# EAGLE design OSO-MISC-20-004 Pulse Oximetry (EAGLE 9.4.2)
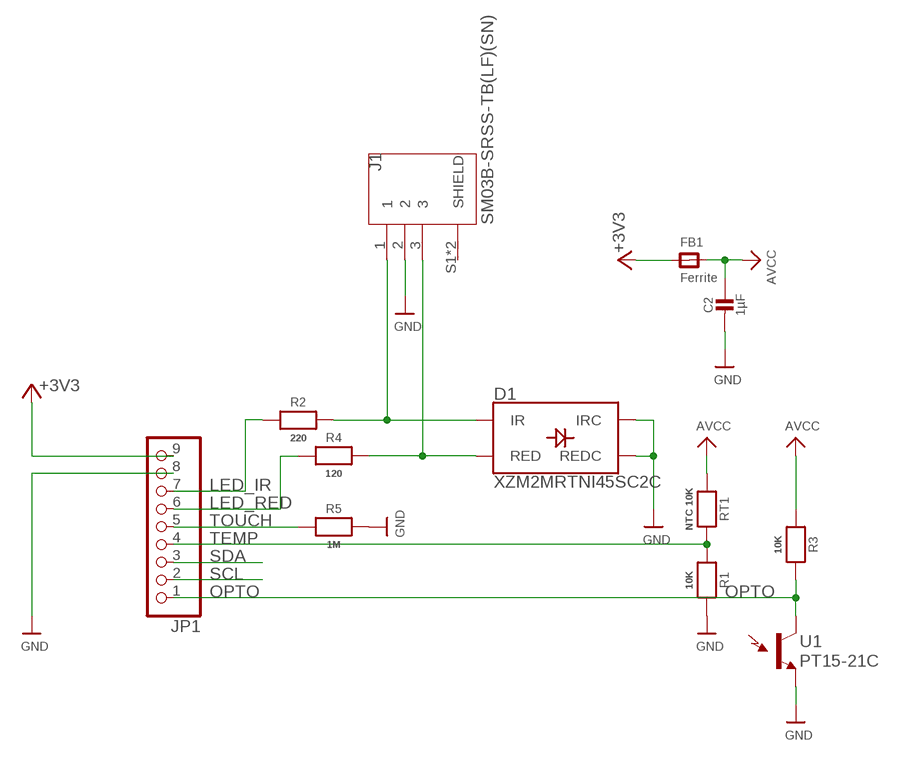
[diagram p0: schematic, sheet 1]

## Parts
C2  1µF  CAP_CERAMIC0805-NOOUTLINE  [0805-NO]
D1  XZM2MRTNI45SC2C  SUNLED_DUAL_RED_IRSMD1  [PLCC4SMDLED]
FB1  Ferrite  FERRITE0805  [0805]
J1  SM03B-SRSS-TB(LF)(SN)  [JST_SM03B-SRSS-TB(LF)(SN)]
JP1  HEADER-1X9_JSTSH  [JST_SH9]
R1  10K  RESISTOR0805_NOOUTLINE  [0805-NO]
R2  220  RESISTOR0805_NOOUTLINE  [0805-NO]
R3  10K  RESISTOR0805_NOOUTLINE  [0805-NO]
R4  120  RESISTOR0805_NOOUTLINE  [0805-NO]
R5  1M  RESISTOR0805_10MGAP  [0805_10MGAP]
RT1  NTC 10K  RESISTOR0805_NOOUTLINE  [0805-NO]
U1  PT15-21C  LIGHT_SENSOR1206  [LED-1206]

## Nets
+3V3: FB1.1 JP1.9
AVCC [power]: C2.1 FB1.2 R3.1 RT1.1
GND [gnd]: C2.2 D1.1(REDC) D1.3(IRC) J1.2 JP1.8 R1.2 R5.2 U1.C(E1)
IR_LIM: D1.4(IR) J1.1 R2.2
LED_IR: JP1.7 R2.1
LED_RED: JP1.6 R4.1
OPTO: JP1.1 R3.2 U1.A(C1)
RED_LIM: D1.2(RED) J1.3 R4.2
SCL: JP1.2
SDA: JP1.3
TEMP: JP1.4 R1.1 RT1.2
TOUCH: JP1.5 R5.1
Unconnected: J1.S1(SHIELD) J1.S2(SHIELD)

## Library data of the parts
C2 = microbuilder:CAP_CERAMIC: Ceramic Capacitors For new designs, use the packages preceded by an '_' character since they are more reliable: The following footprints should be used on most boards: _0402 - Standard footprint for regular board layouts _0603 - Standard footprint for regular board layouts _0805 - Standard footprint for regular board layouts _1206 - Standard footprint for regular board layouts For extremely tight-pitch boards where space is at a premium, the following 'micro-pitch' footprints can be used (smaller pads, no silkscreen outline, etc.): _0402MP - Micro-pitch footprint for very dense/compact boards _0603MP - Micro-pitch footprint for very dense/compact boards _0805MP - Micro-pitch footprint for very dense/compact boards _1206MP - Micro-pitch footprint for very dense/compact boards
D1 = My Stuff:SUNLED_DUAL_RED_IR: LED-RGB Common Cathode XZM2CRKM2DGFBB45SCCB Packages: PLCC4 SparkFun Products: Lilypad Prototyping Board <[https://www.sparkfun.com/products/9264]>; PROD_ID: DIO-13722; VALUE: XZM2CRKM2DGFBB45SCCB
FB1 = microbuilder:FERRITE: Ferrite Bead 0603 MMZ1608B121C - 120 Ohm @ 100MHz, 600mA, 0.15 Ohm DC Resistance - Digikey: 445-2164-1-ND BK1608HW121-T - 120 Ohm, 600mA Ferrite Chip - Digikey: 587-1876-2-ND 0805 HZ0805B272R-10 - 2.7K Ohm @ 100MHz, 200mA, 0.8 Ohm DC Resistance - Digikey: 240-2504-1-ND (see also Murata BLM21BD272SN1L) MMZ2012Y152B - 1.5K Ohm @ 100MHz, 500mA, 0.4 Ohm DC Resistance - Digikey: 445-1560-1-ND - Mainly for high frequency (80-400MHz) MMZ2012R102A - 1K Ohm @ 100MHz, 500mA, 0.3 Ohm DC Resistance - Digikey: 445-1555-2-ND - More general purpose (10-200MHz)
J1 = SM03B-SRSS-TB_LF__SN_-2:SM03B-SRSS-TB(LF)(SN): SH Series 3 Position 1 mm Pitch Surface Mount Side Entry Shrouded Header; DESCRIPTION: Connector Header Surface Mount, Right Angle 3 position 0.039 _1.00mm_; DIGI-KEY_PART_NUMBER: 455-1803-1-ND; DIGI-KEY_PURCHASE_URL: https://www.digikey.com/product-detail/en/jst-sales-america-inc/SM03B-SRSS-TB_LF__SN_/455-1803-1-ND/926874?utm_source=snapeda&utm_medium=aggregator&utm_campaign=symbol; MF: JST Sales; MP: SM03B-SRSS-TB_LF__SN_; PACKAGE: None
JP1 = microbuilder:HEADER-1X9: PIN HEADER
R1-R5 RT1 = microbuilder:RESISTOR: Resistors For new designs, use the packages preceded by an '_' character since they are more reliable: The following footprints should be used on most boards: _0402 - Standard footprint for regular board layouts _0603 - Standard footprint for regular board layouts _0805 - Standard footprint for regular board layouts _1206 - Standard footprint for regular board layouts For extremely tight-pitch boards where space is at a premium, the following 'micro-pitch' footprints can be used (smaller pads, no silkscreen outline, etc.): _0402MP - Micro-pitch footprint for very dense/compact boards _0603MP - Micro-pitch footprint for very dense/compact boards _0805MP - Micro-pitch footprint for very dense/compact boards _1206MP - Micro-pitch footprint for very dense/compact boards
U1 = SparkFun-Sensors:LIGHT_SENSOR: Ambient Light Sensors - Phototransistors Low cost ambient light sensors, consisting of a phototransistor in miniature SMD packages. Output voltage varies with light intensity. SparkFun Products ALS-PT19 Light Sensor <https://www.sparkfun.com/products/12566> (SEN-12566) Ambient Light Sensor - TEMT6000 <https://www.sparkfun.com/products/8348> (SEN-08348) SparkFun Ambient Light Sensor Breakout - TEMT60000 <https://www.sparkfun.com/products/8688> (SEN-08688)

## Net classes
0 default: width 0.152 mm, drill 0.254 mm
1 power: width 0.305 mm, drill 0.305 mm

## Board
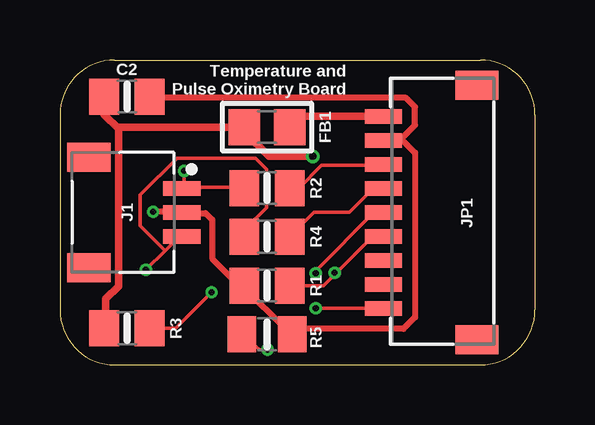
[diagram p1: board, top side]
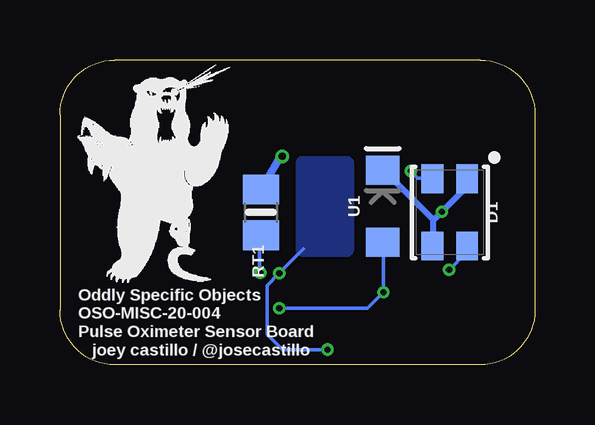
[diagram p2: board, bottom side, seen from below]

Size 19.81 x 12.7 mm. Coordinates in mm from the lower left corner, seen from the top.
Outline: 19.81,10.41 arc90 17.53,12.7 2.29,12.7 arc90 0,10.41 0,2.29 arc90 2.29,0 17.53,0 arc90 19.81,2.29 19.81,10.41
Copper layers (1*16): Top 0.035559375mm / dielectric 1.6mm / Bottom 0.035559375mm
Design rules "oshpark-2layer *": minimum track width 6mil, minimum drill 10mil, track to track 6mil, track to pad 6mil, pad to pad 6mil, via to via 6mil, smd to smd 6mil, copper to edge 15mil, drill to drill 6mil, minimum pad ring 5mil, minimum via ring 5mil, stop-mask expansion 2.5mil, vias tented up to drill 12mil, thermal gap 10mil

### Footprints (pad centres in the part's own frame; a part is rotated, then mirrored left to right if it is on the bottom)
0805-NO = smd 1.24 x 1.5: 1 -0.95,0; 2 0.95,0
PLCC4SMDLED = smd 1.2 x 0.9: 1 -1.4,0.725; 2 1.4,0.725; 3 1.4,-0.725; 4 -1.4,-0.725
0805 = smd 1.3 x 1.5: 1 -0.95,0; 2 0.95,0
JST_SM03B-SRSS-TB(LF)(SN) = smd 0.6 x 1.55: 1 -1,0; 2 0,0; 3 1,0 | smd 1.2 x 1.8: S1 -2.3,-3.875; S2 2.3,-3.875
JST_SH9 = smd 0.6 x 1.55: 1 -4,2.514; 2 -3,2.514; 3 -2,2.514; 4 -1,2.514; 5 0,2.514; 6 1,2.514; 7 2,2.514; 8 3,2.514; 9 4,2.514 | smd 1.2 x 1.8: MT1 -5.3,-1.386; MT2 5.3,-1.386
0805_10MGAP = smd 1.2 x 1.5: 1 -1.05,0; 2 1.05,0
LED-1206 = smd 1.2 x 1.4: A -1.5,0; C 1.5,0

### Placement (x,y rotation side)
C2  2.79,11.18 0 top
D1  3.56,6.35 270 bottom
FB1  8.64,9.91 180 top
J1  5.08,6.35 270 top
JP1  16,6.35 90 top
R1  8.64,3.3 180 top
R2  8.64,7.37 180 top
R3  2.79,1.52 0 top
R4  8.64,5.33 180 top
R5  8.64,1.27 0 top
RT1  11.43,6.35 270 bottom
U1  6.35,6.6 90 bottom
U$2  [OSO_BEAR_250X360MIL_1000DPI]  15.88,8 0 bottom

### Tracks (layer width: path | path; a pad name or v marks a point on that pad's centre or on a via)
+3V3
  Top 0.305: JP1.9 10.03,10.35 FB1.1
AVCC  (via drill 0.3)
  Top 0.305: 2.44,9.83 2.44,9.91 FB1.2 7.69,9.71 8.71,8.69 v10.54,8.69 | 2.44,9.83 2.44,3.28 1.91,2.74 1.91,1.52 R3.1 | 2.44,9.83 1.84,10.42 C2.1
  Bottom 0.305: v10.54,8.69 10.69,8.54 RT1.1
GND  (via drill 0.25)
  Top 0.152: 14.2,9.37 13.56,9.37 JP1.8 | 3.81,11.12 C2.2 | 9.4,1.5 9.63,1.27 R5.2
  Top 0.254: 3.81,11.12 14.43,11.12 14.81,10.74 14.81,9.98 14.2,9.37 | v3.89,6.38 4.55,6.38 4.57,6.35 J1.2 5.11,6.33 6.07,6.33 6.35,6.04 6.35,4.42 7.47,3.3 R1.2 7.69,3.21 9.4,1.5 14.33,1.5 14.81,1.98 14.81,8.84 14.26,9.38 13.52,9.38 JP1.8
  Bottom 0.152: 4.27,4.95 D1.3 | 6.27,8.08 6.33,8.08 U1.C
  Bottom 0.254: 4.27,6.07 4.27,4.95 | 4.27,6.07 6.27,8.08 | 4.27,6.07 4.19,6.07 v3.89,6.38 2.83,7.43 D1.1
IR_LIM  (via drill 0.25)
  Top 0.152: v5.18,8.08 5.18,7.47 5.11,7.39 J1.1 5.18,7.39 7.62,7.39 R2.2
  Bottom 0.152: v5.18,8.08 4.88,7.77 4.34,7.77 D1.4
LED_IR
  Top 0.152: R2.1 9.97,7.37 10.91,8.31 13.49,8.31 JP1.7
LED_RED
  Top 0.152: R4.1 10.6,6.35 12.06,6.35 13.03,7.32 13.49,7.32 JP1.6
OPTO  (via drill 0.25)
  Top 0.152: v6.33,3.02 4.83,1.52 R3.2 | v10.67,2.36 13.49,2.36 JP1.1
  Bottom 0.152: U1.A 6.33,5.03 v6.33,3.02 6.99,2.36 v10.67,2.36
RED_LIM  (via drill 0.25)
  Top 0.152: 4.38,4.76 5.03,5.41 J1.3 | 4.38,4.76 v3.58,3.96 | 4.38,4.76 3.35,5.79 3.35,7.09 4.88,8.61 8.15,8.61 8.61,8.15 8.61,6.55 7.7,5.64 R4.2
  Bottom 0.152: v3.58,3.96 2.9,4.65 2.9,4.88 D1.2
TEMP  (via drill 0.25)
  Top 0.152: R1.1 11,3.3 11.46,3.76 | JP1.4 13.49,5.33 13.03,5.33 11.46,3.76 | v11.46,3.83 11.46,3.76
  Bottom 0.152: v11.46,3.83 11.48,3.86 11.48,5.33 RT1.2
TOUCH  (via drill 0.25)
  Top 0.152: R5.1 8.32,0.64 v8.66,0.64 | v10.67,3.81 10.67,3.93 13.09,6.35 JP1.5
  Bottom 0.152: v8.66,0.64 10.54,0.64 11.18,1.27 11.18,3.3 v10.67,3.81 9.65,4.83
  pour Bottom: 7.62,8.38 arc-90 7.87,8.64 9.65,8.64 arc-90 9.91,8.38 9.91,4.83 arc-90 9.65,4.57 7.87,4.57 arc-90 7.62,4.83

### Text on the board
tPlace: Temperature and / Pulse Oximetry Board
bPlace: Oddly Specific Objects / OSO-MISC-20-004 / Pulse Oximeter Sensor Board / joey castillo / @josecastillo